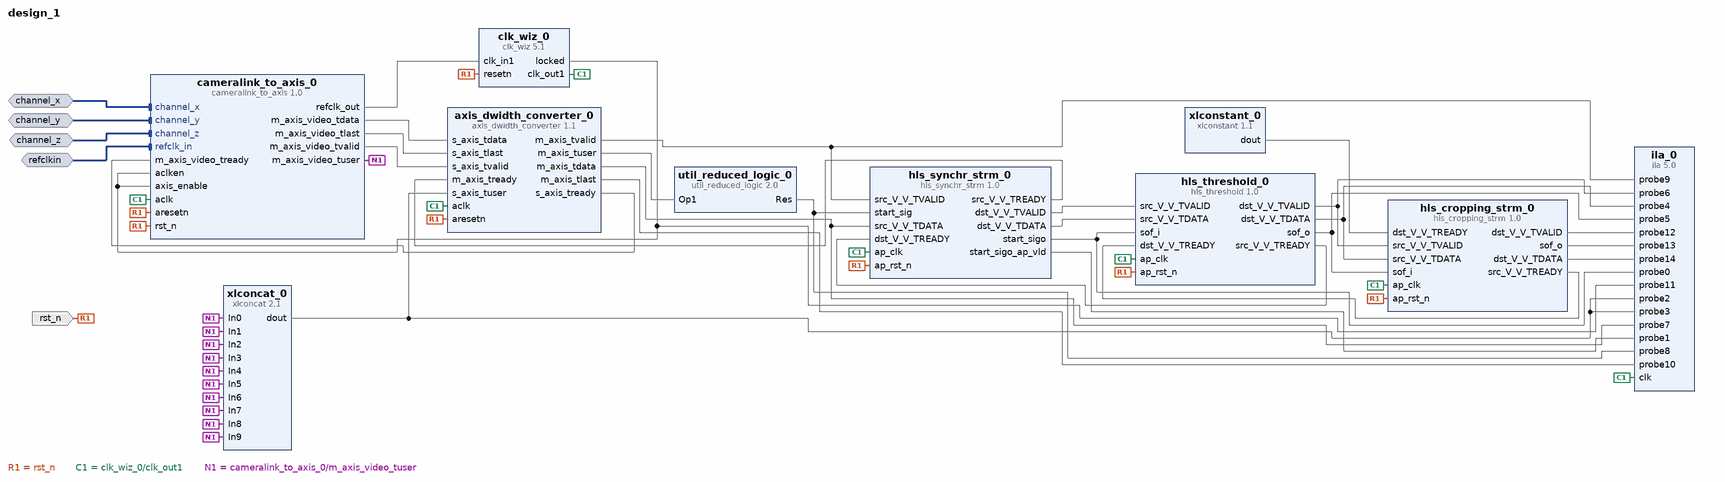
[diagram p0: block diagram of the top level]
# Vivado block design design_1, Vivado 2014.4
create_bd_design design_1

create_bd_intf_port -mode Slave -vlnv xilinx.com:interface:channel_link_rtl:1.0 channel_x
create_bd_intf_port -mode Slave -vlnv xilinx.com:interface:channel_link_rtl:1.0 channel_y
create_bd_intf_port -mode Slave -vlnv xilinx.com:interface:channel_link_rtl:1.0 channel_z
create_bd_intf_port -mode Slave -vlnv xilinx.com:interface:diff_clock_rtl:1.0 refclkin
create_bd_port -dir I rst_n

create_bd_cell -type ip -vlnv Xilinx.com:user:cameralink_to_axis:1.0 cameralink_to_axis_0
create_bd_cell -type ip -vlnv xilinx.com:ip:axis_dwidth_converter:1.1 axis_dwidth_converter_0
set_property -dict [list \
  CONFIG.S_TDATA_NUM_BYTES 10 \
  CONFIG.M_TDATA_NUM_BYTES 8 \
  CONFIG.TUSER_BITS_PER_BYTE 1 \
  CONFIG.HAS_TLAST 1 \
  CONFIG.HAS_MI_TKEEP 1 \
] [get_bd_cells axis_dwidth_converter_0]
create_bd_cell -type ip -vlnv xilinx.com:ip:util_reduced_logic:2.0 util_reduced_logic_0
create_bd_cell -type ip -vlnv xilinx.com:ip:clk_wiz:5.1 clk_wiz_0
set_property -dict [list \
  CONFIG.PRIMITIVE PLL \
  CONFIG.PRIM_IN_FREQ 48.5 \
  CONFIG.CLKIN1_JITTER_PS 206.18 \
  CONFIG.CLKOUT2_USED false \
  CONFIG.NUM_OUT_CLKS 1 \
  CONFIG.CLKOUT1_REQUESTED_OUT_FREQ 100.000 \
  CONFIG.RESET_TYPE ACTIVE_LOW \
  CONFIG.CLKOUT1_JITTER 274.786 \
  CONFIG.CLKOUT1_PHASE_ERROR 271.448 \
  CONFIG.CLKOUT2_JITTER 116.565 \
  CONFIG.CLKOUT2_PHASE_ERROR 127.730 \
] [get_bd_cells clk_wiz_0]
create_bd_cell -type ip -vlnv xilinx.com:ip:xlconcat:2.1 xlconcat_0
set_property -dict {CONFIG.NUM_PORTS 10} [get_bd_cells xlconcat_0]
create_bd_cell -type ip -vlnv xilinx.com:hls:hls_synchr_strm:1.0 hls_synchr_strm_0
create_bd_cell -type ip -vlnv xilinx.com:hls:hls_threshold:1.0 hls_threshold_0
create_bd_cell -type ip -vlnv xilinx.com:ip:ila:5.0 ila_0
set_property -dict [list \
  CONFIG.C_PROBE14_WIDTH 16 \
  CONFIG.C_PROBE7_WIDTH 64 \
  CONFIG.C_PROBE4_WIDTH 8 \
  CONFIG.C_PROBE0_WIDTH 1 \
  CONFIG.C_NUM_OF_PROBES 15 \
  CONFIG.C_ENABLE_ILA_AXI_MON false \
  CONFIG.C_MONITOR_TYPE Native \
] [get_bd_cells ila_0]
create_bd_cell -type ip -vlnv xilinx.com:hls:hls_cropping_strm:1.0 hls_cropping_strm_0
create_bd_cell -type ip -vlnv xilinx.com:ip:xlconstant:1.1 xlconstant_0

# ---- connections ----

connect_bd_intf_net [get_bd_intf_ports channel_x] [get_bd_intf_pins cameralink_to_axis_0/channel_x]
connect_bd_intf_net [get_bd_intf_ports channel_y] [get_bd_intf_pins cameralink_to_axis_0/channel_y]
connect_bd_intf_net [get_bd_intf_ports channel_z] [get_bd_intf_pins cameralink_to_axis_0/channel_z]
connect_bd_intf_net [get_bd_intf_ports refclkin] [get_bd_intf_pins cameralink_to_axis_0/refclk_in]
connect_bd_net [get_bd_ports rst_n] \
  [get_bd_pins cameralink_to_axis_0/rst_n] [get_bd_pins cameralink_to_axis_0/aresetn] \
  [get_bd_pins axis_dwidth_converter_0/aresetn] [get_bd_pins clk_wiz_0/resetn] [get_bd_pins hls_synchr_strm_0/ap_rst_n] \
  [get_bd_pins hls_threshold_0/ap_rst_n] [get_bd_pins hls_cropping_strm_0/ap_rst_n]
connect_bd_net [get_bd_pins cameralink_to_axis_0/m_axis_video_tdata] [get_bd_pins axis_dwidth_converter_0/s_axis_tdata]
connect_bd_net [get_bd_pins cameralink_to_axis_0/m_axis_video_tlast] [get_bd_pins axis_dwidth_converter_0/s_axis_tlast]
connect_bd_net [get_bd_pins axis_dwidth_converter_0/s_axis_tready] [get_bd_pins cameralink_to_axis_0/m_axis_video_tready]
connect_bd_net [get_bd_pins cameralink_to_axis_0/m_axis_video_tvalid] [get_bd_pins axis_dwidth_converter_0/s_axis_tvalid]
connect_bd_net [get_bd_pins axis_dwidth_converter_0/m_axis_tuser] [get_bd_pins util_reduced_logic_0/Op1]
connect_bd_net [get_bd_pins cameralink_to_axis_0/refclk_out] [get_bd_pins clk_wiz_0/clk_in1]
connect_bd_net [get_bd_pins clk_wiz_0/clk_out1] \
  [get_bd_pins axis_dwidth_converter_0/aclk] [get_bd_pins cameralink_to_axis_0/aclk] [get_bd_pins hls_synchr_strm_0/ap_clk] \
  [get_bd_pins hls_threshold_0/ap_clk] [get_bd_pins ila_0/clk] [get_bd_pins hls_cropping_strm_0/ap_clk]
connect_bd_net [get_bd_pins clk_wiz_0/locked] \
  [get_bd_pins cameralink_to_axis_0/aclken] [get_bd_pins cameralink_to_axis_0/axis_enable] [get_bd_pins ila_0/probe11]
connect_bd_net [get_bd_pins cameralink_to_axis_0/m_axis_video_tuser] \
  [get_bd_pins xlconcat_0/In0] [get_bd_pins xlconcat_0/In1] [get_bd_pins xlconcat_0/In2] [get_bd_pins xlconcat_0/In3] \
  [get_bd_pins xlconcat_0/In4] [get_bd_pins xlconcat_0/In5] [get_bd_pins xlconcat_0/In6] [get_bd_pins xlconcat_0/In7] \
  [get_bd_pins xlconcat_0/In8] [get_bd_pins xlconcat_0/In9]
connect_bd_net [get_bd_pins xlconcat_0/dout] [get_bd_pins axis_dwidth_converter_0/s_axis_tuser] [get_bd_pins ila_0/probe2] [get_bd_pins ila_0/probe3]
connect_bd_net [get_bd_pins axis_dwidth_converter_0/m_axis_tvalid] [get_bd_pins hls_synchr_strm_0/src_V_V_TVALID] [get_bd_pins ila_0/probe9]
connect_bd_net [get_bd_pins hls_synchr_strm_0/src_V_V_TREADY] [get_bd_pins axis_dwidth_converter_0/m_axis_tready]
connect_bd_net [get_bd_pins axis_dwidth_converter_0/m_axis_tdata] [get_bd_pins hls_synchr_strm_0/src_V_V_TDATA] [get_bd_pins ila_0/probe7]
connect_bd_net [get_bd_pins util_reduced_logic_0/Res] [get_bd_pins hls_synchr_strm_0/start_sig] [get_bd_pins ila_0/probe8]
connect_bd_net [get_bd_pins hls_synchr_strm_0/dst_V_V_TVALID] [get_bd_pins hls_threshold_0/src_V_V_TVALID]
connect_bd_net [get_bd_pins hls_threshold_0/src_V_V_TREADY] [get_bd_pins hls_synchr_strm_0/dst_V_V_TREADY]
connect_bd_net [get_bd_pins hls_synchr_strm_0/dst_V_V_TDATA] [get_bd_pins hls_threshold_0/src_V_V_TDATA]
connect_bd_net [get_bd_pins hls_synchr_strm_0/start_sigo] [get_bd_pins hls_threshold_0/sof_i] [get_bd_pins ila_0/probe0]
connect_bd_net [get_bd_pins hls_threshold_0/dst_V_V_TVALID] [get_bd_pins ila_0/probe6] [get_bd_pins hls_cropping_strm_0/src_V_V_TVALID]
connect_bd_net [get_bd_pins hls_threshold_0/dst_V_V_TDATA] [get_bd_pins ila_0/probe4] [get_bd_pins hls_cropping_strm_0/src_V_V_TDATA]
connect_bd_net [get_bd_pins hls_threshold_0/sof_o] [get_bd_pins ila_0/probe5] [get_bd_pins hls_cropping_strm_0/sof_i]
connect_bd_net [get_bd_pins axis_dwidth_converter_0/m_axis_tlast] [get_bd_pins ila_0/probe10]
connect_bd_net [get_bd_pins hls_synchr_strm_0/start_sigo_ap_vld] [get_bd_pins ila_0/probe1]
connect_bd_net [get_bd_pins hls_cropping_strm_0/src_V_V_TREADY] [get_bd_pins hls_threshold_0/dst_V_V_TREADY]
connect_bd_net [get_bd_pins xlconstant_0/dout] [get_bd_pins hls_cropping_strm_0/dst_V_V_TREADY]
connect_bd_net [get_bd_pins hls_cropping_strm_0/dst_V_V_TVALID] [get_bd_pins ila_0/probe12]
connect_bd_net [get_bd_pins hls_cropping_strm_0/sof_o] [get_bd_pins ila_0/probe13]
connect_bd_net [get_bd_pins hls_cropping_strm_0/dst_V_V_TDATA] [get_bd_pins ila_0/probe14]

validate_bd_design
save_bd_design
